# Altium schematic sheet AIMLAB_TESTSTATION_ADC_V1.schdoc
size D
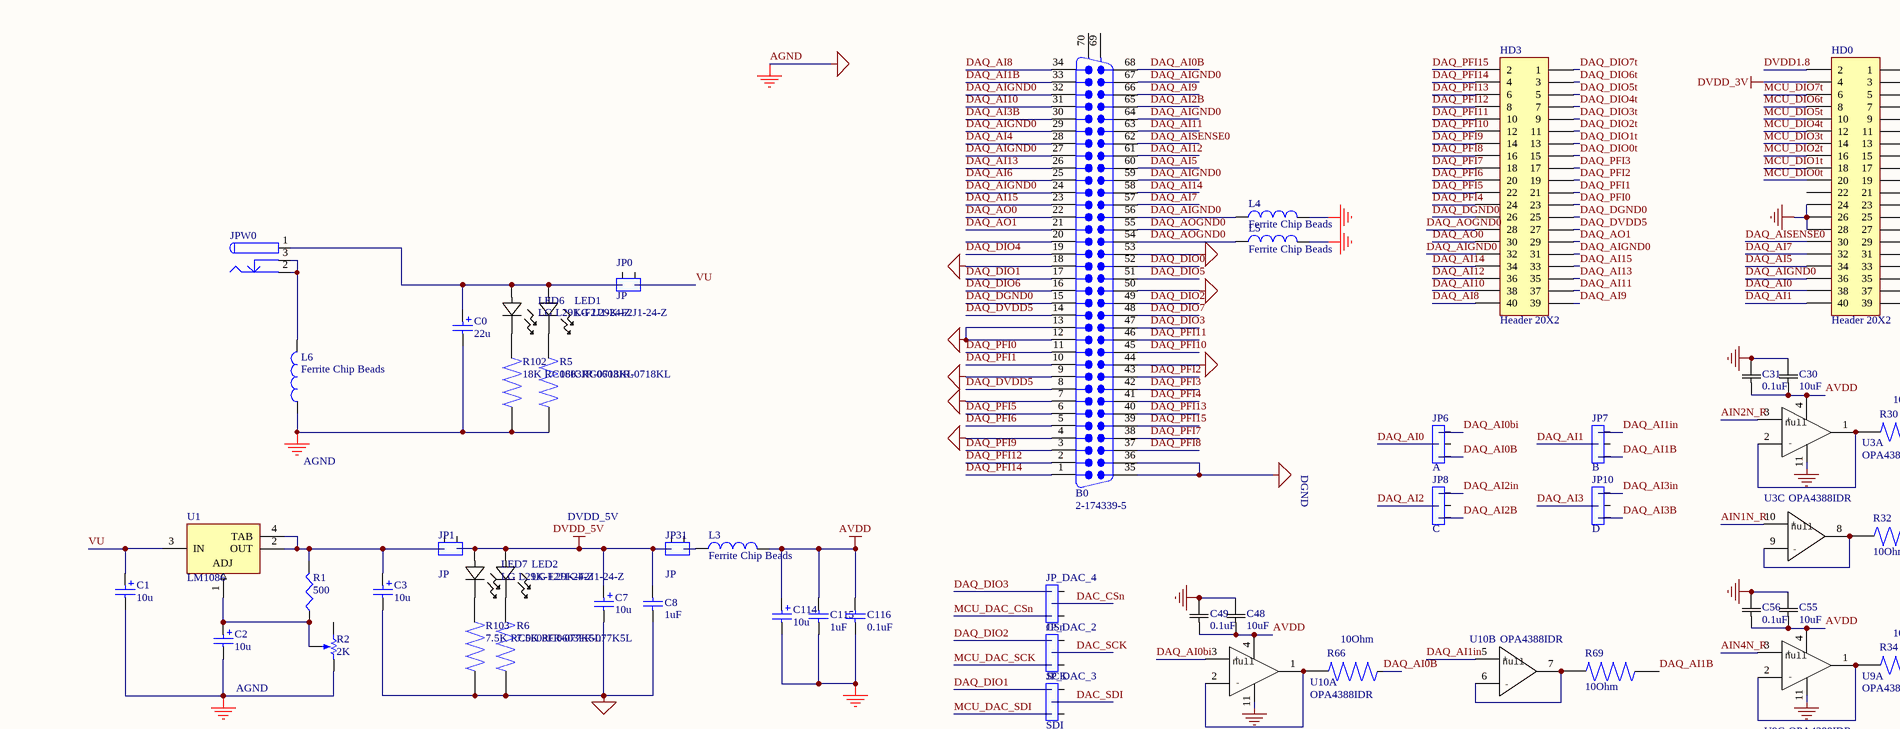
[diagram p0: AIMLAB_TESTSTATION_ADC_V1.schdoc, top left]
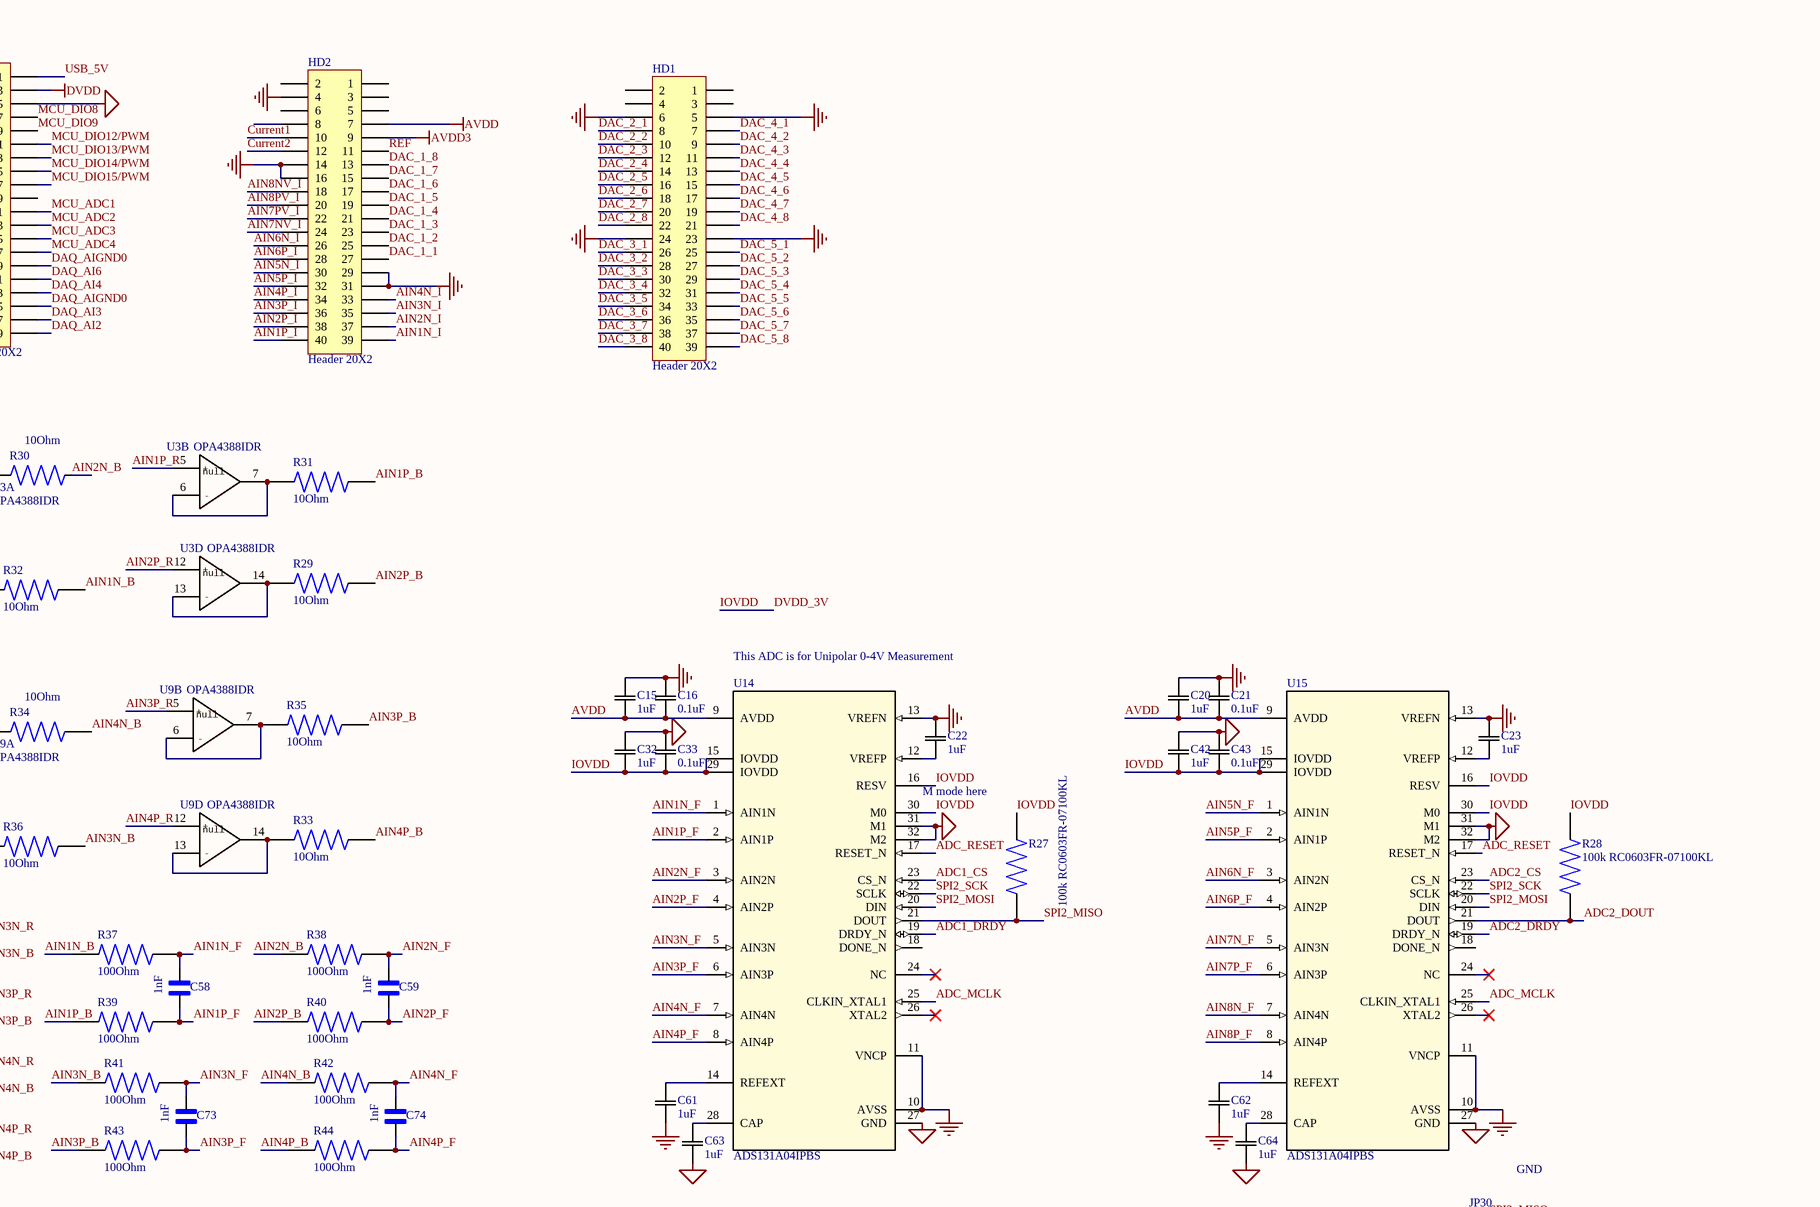
[diagram p1: AIMLAB_TESTSTATION_ADC_V1.schdoc, top right]
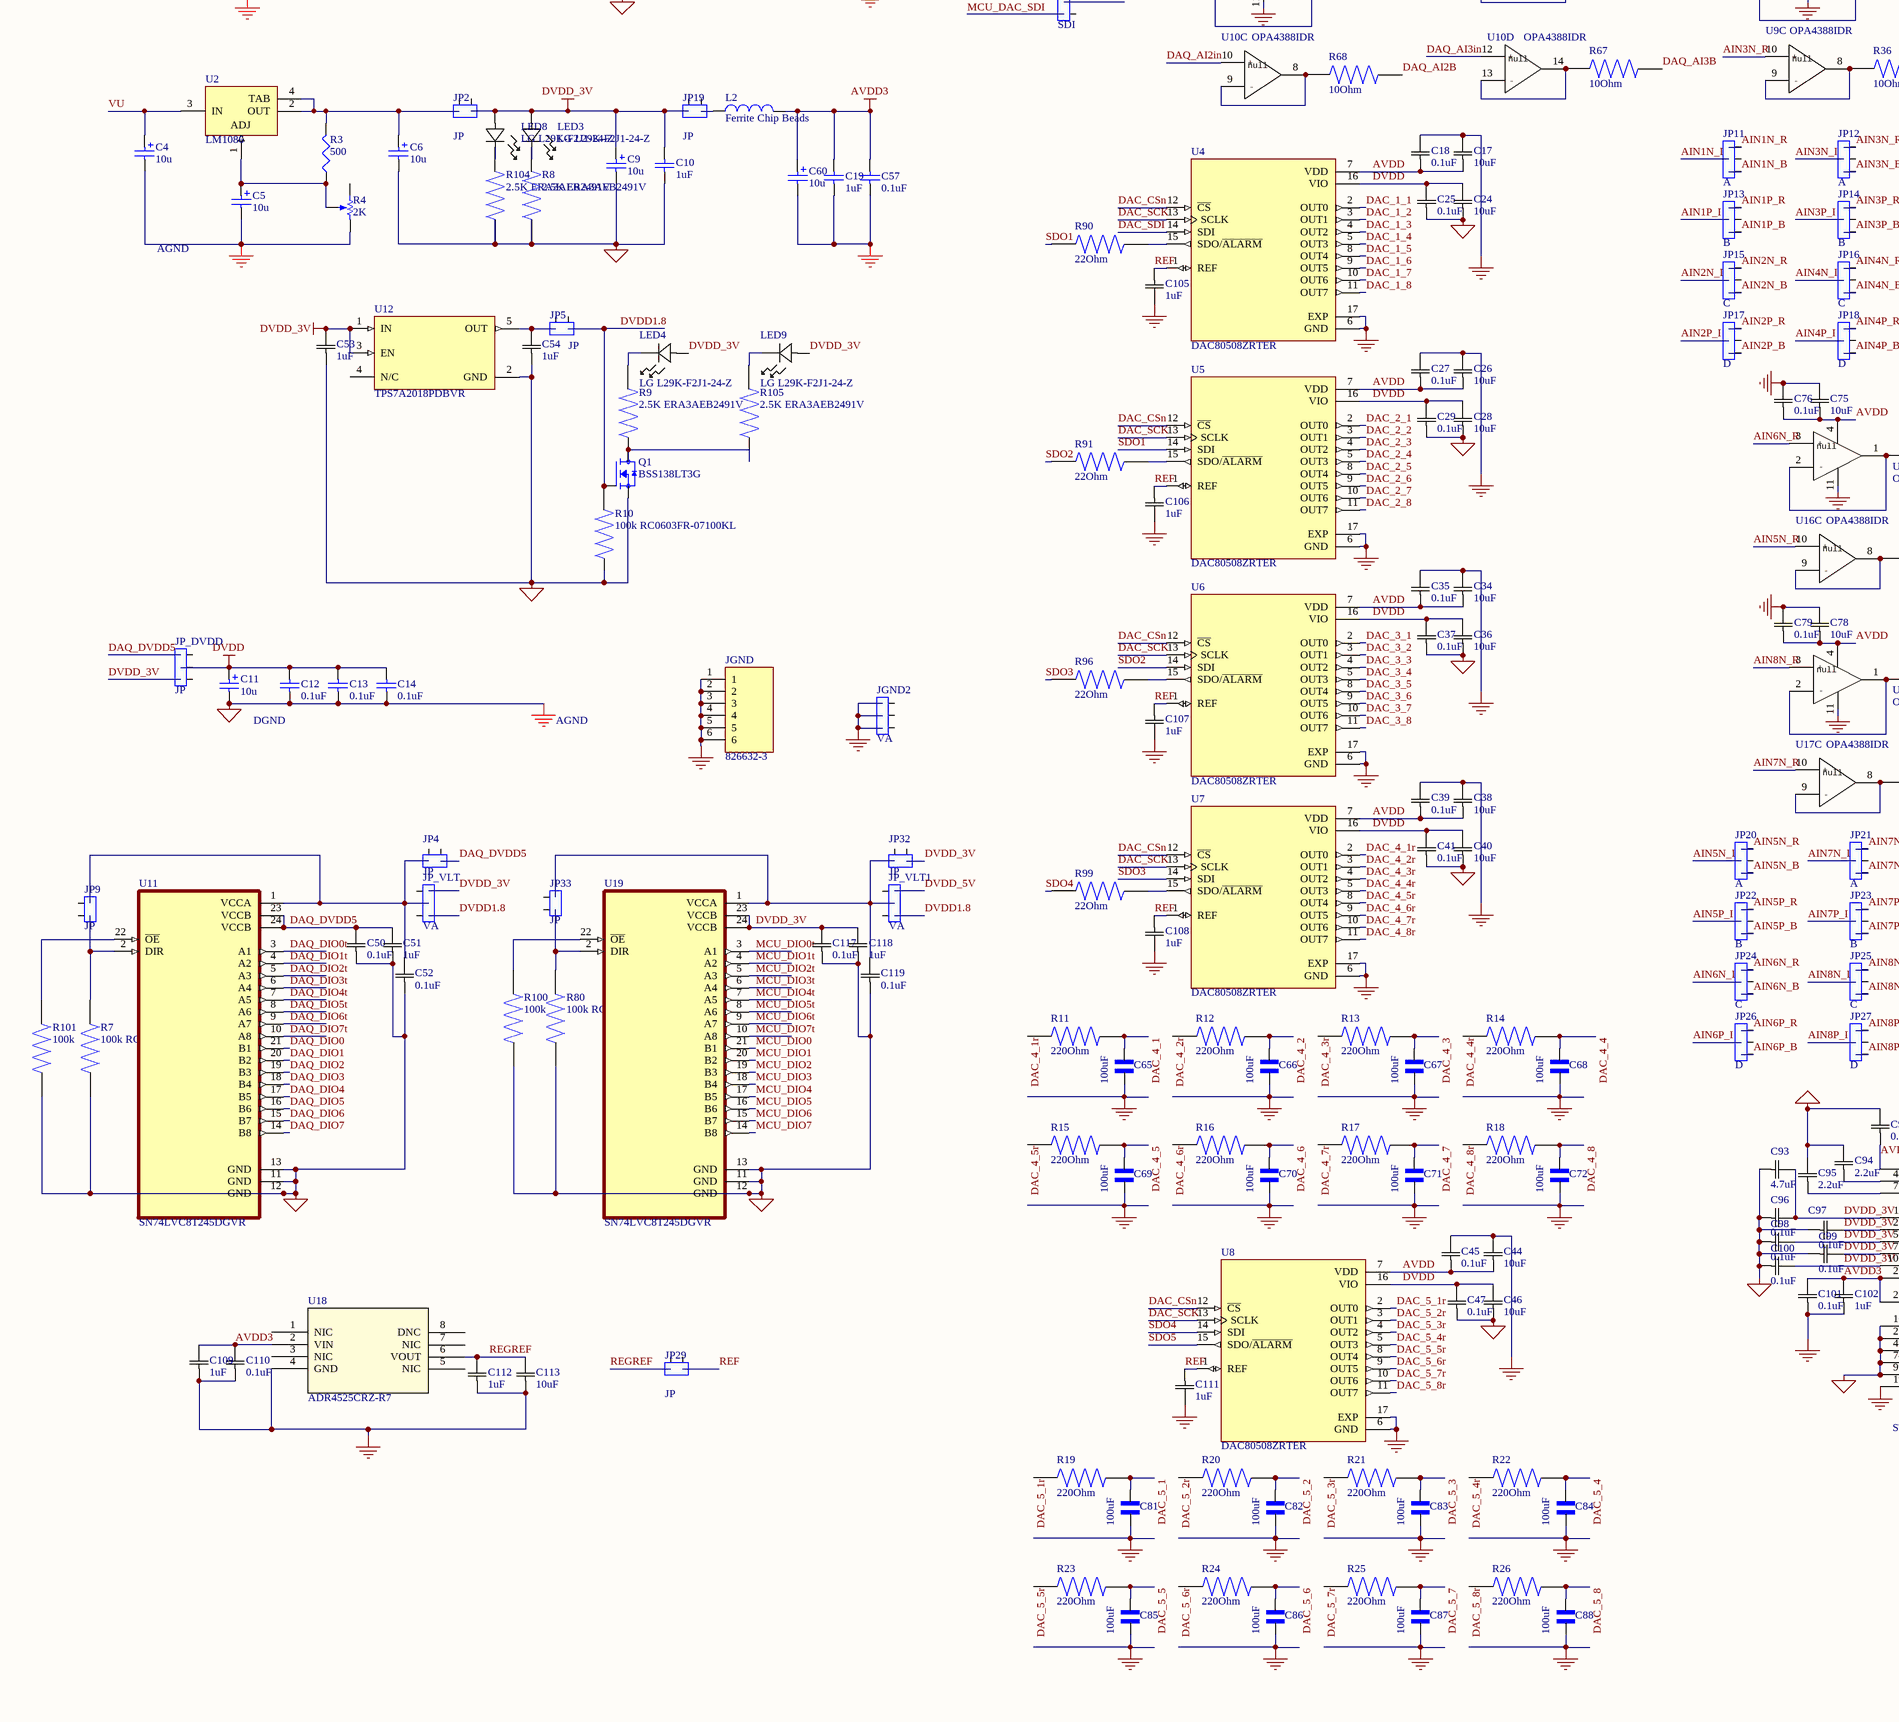
[diagram p2: AIMLAB_TESTSTATION_ADC_V1.schdoc, bottom left]
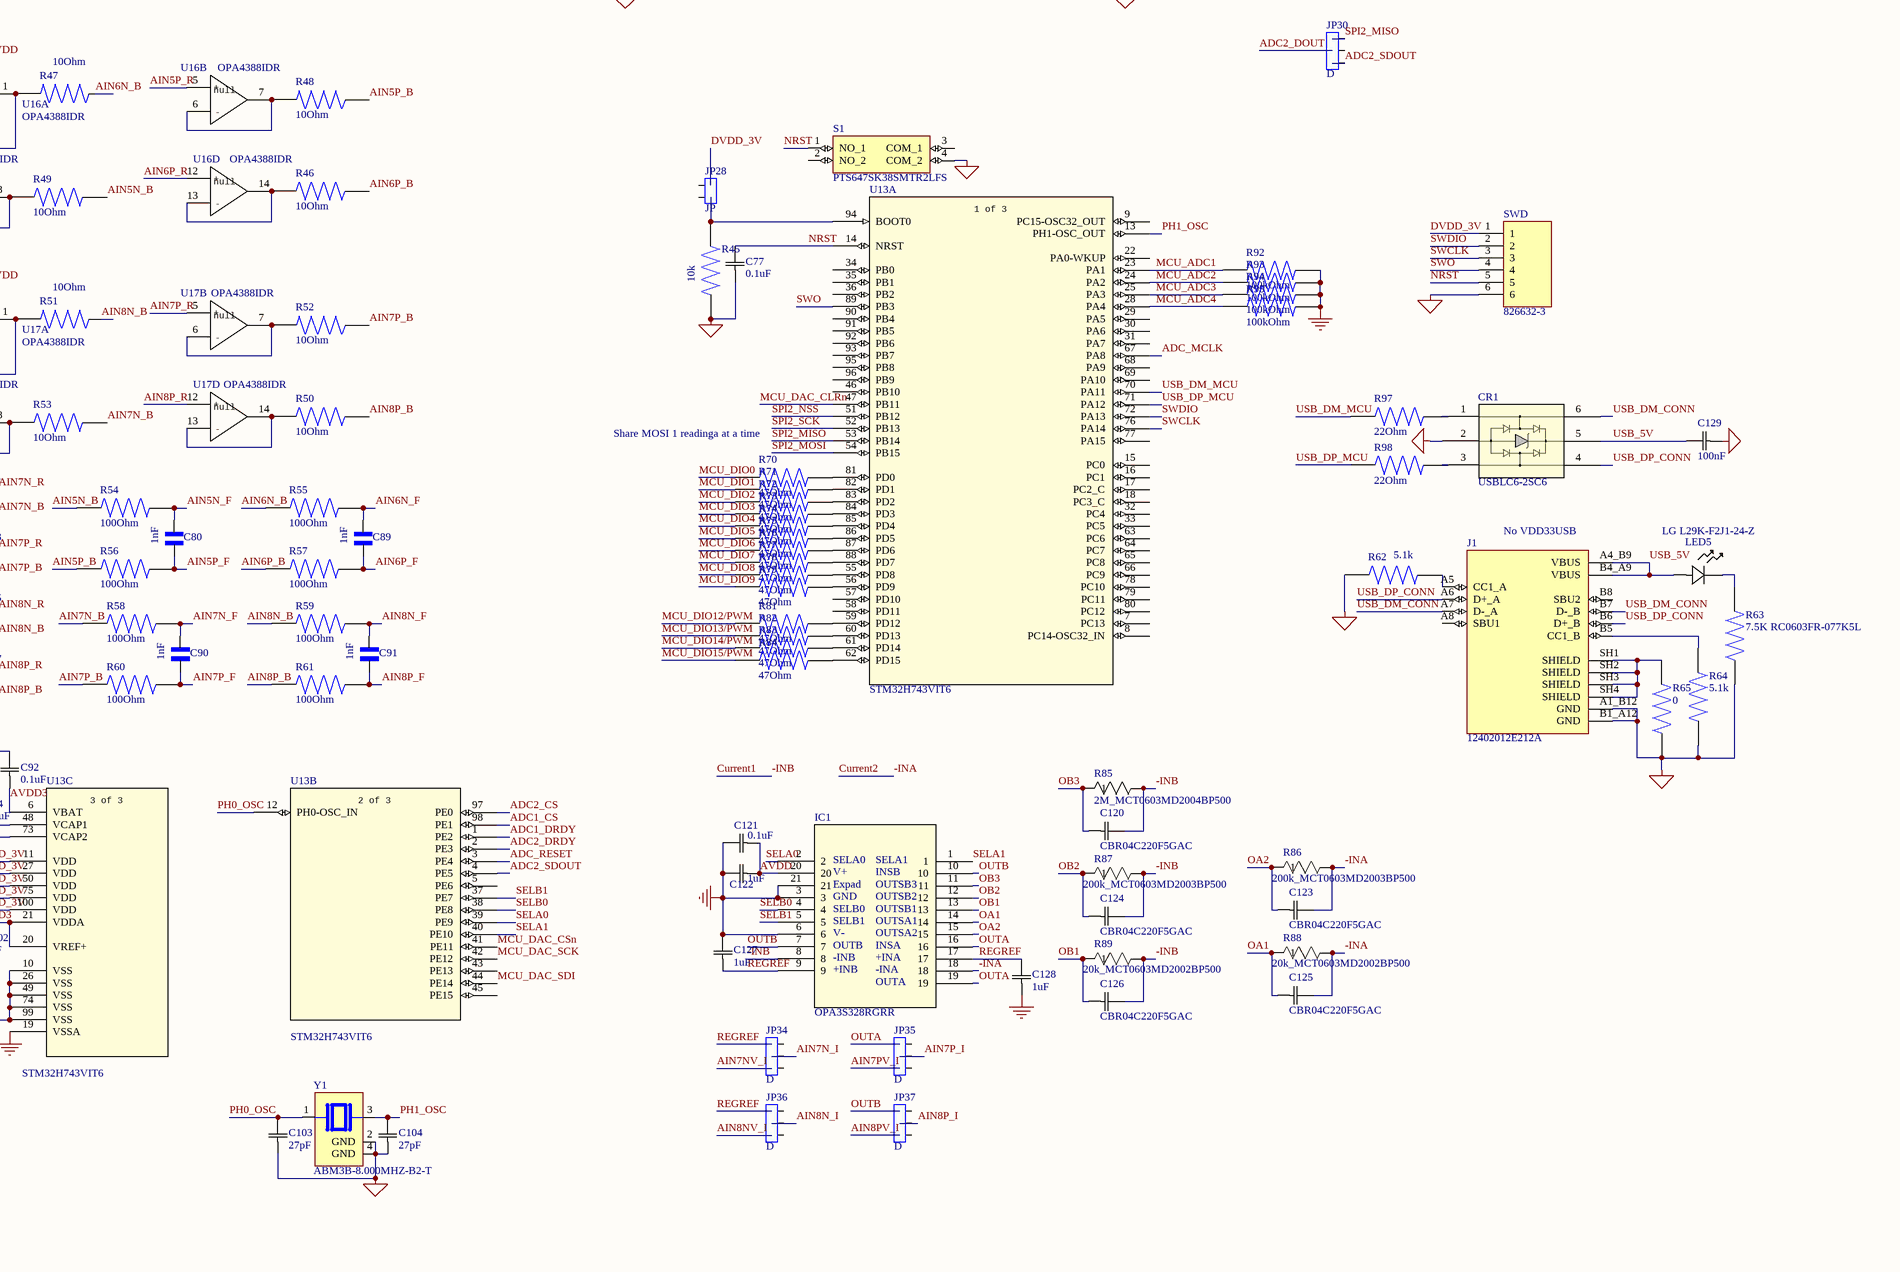
[diagram p3: AIMLAB_TESTSTATION_ADC_V1.schdoc, bottom right]

## Parts
B0  2-174339-5  [CONN68_5174339_TEC]
C0  22u  [PolarizedCap]
C1  10u  [PolarizedCap]
C2  10u  [PolarizedCap]
C3  10u  [PolarizedCap]
C4  10u  [PolarizedCap]
C5  10u  [PolarizedCap]
C6  10u  [PolarizedCap]
C7  10u  [PolarizedCap]
C8  1uF  [CAPC2012X140N]
C9  10u  [PolarizedCap]
C10  1uF  [CAPC2012X140N]
C11  10u  [PolarizedCap]
C12  0.1uF  [CAPC2012X140N]
C13  0.1uF  [CAPC2012X140N]
C14  0.1uF  [CAPC2012X140N]
C15  1uF  [CAPC1608X90]
C16  0.1uF  [CAPC1608X90]
C17  10uF  [CAPC2012X140N]
C18  0.1uF  [CAPC1608X90]
C19  1uF  [CAPC2012X140N]
C20  1uF  [CAPC1608X90]
C21  0.1uF  [CAPC1608X90]
C22  1uF  [CAPC1608X90]
C23  1uF  [CAPC1608X90]
C24  10uF  [CAPC2012X140N]
C25  0.1uF  [CAPC1608X90]
C26  10uF  [CAPC2012X140N]
C27  0.1uF  [CAPC1608X90]
C28  10uF  [CAPC2012X140N]
C29  0.1uF  [CAPC1608X90]
C30  10uF  [CAPC2012X140N]
C31  0.1uF  [CAPC1608X90]
C32  1uF  [CAPC1608X90]
C33  0.1uF  [CAPC1608X90]
C34  10uF  [CAPC2012X140N]
C35  0.1uF  [CAPC1608X90]
C36  10uF  [CAPC2012X140N]
C37  0.1uF  [CAPC1608X90]
C38  10uF  [CAPC2012X140N]
C39  0.1uF  [CAPC1608X90]
C40  10uF  [CAPC2012X140N]
C41  0.1uF  [CAPC1608X90]
C42  1uF  [CAPC1608X90]
C43  0.1uF  [CAPC1608X90]
C44  10uF  [CAPC2012X140N]
C45  0.1uF  [CAPC1608X90]
C46  10uF  [CAPC2012X140N]
C47  0.1uF  [CAPC1608X90]
C48  10uF  [CAPC2012X140N]
C49  0.1uF  [CAPC1608X90]
C50  0.1uF  [CAPC1608X90]
C51  1uF  [CAPC1608X90]
C52  0.1uF  [CAPC1608X90]
C53  1uF  [CAPC2012X140N]
C54  1uF  [CAPC2012X140N]
C55  10uF  [CAPC2012X140N]
C56  0.1uF  [CAPC1608X90]
C57  0.1uF  [CAPC2012X140N]
C58  1nF  [CAPC2012X145N]
C59  1nF  [CAPC2012X145N]
C60  10u  [PolarizedCap]
C61  1uF  [CAPC1608X90]
C62  1uF  [CAPC1608X90]
C63  1uF  [CAPC1608X90]
C64  1uF  [CAPC1608X90]
C65  100uF  [CAPC2012X145N]
C66  100uF  [CAPC2012X145N]
C67  100uF  [CAPC2012X145N]
C68  100uF  [CAPC2012X145N]
C69  100uF  [CAPC2012X145N]
C70  100uF  [CAPC2012X145N]
C71  100uF  [CAPC2012X145N]
C72  100uF  [CAPC2012X145N]
C73  1nF  [CAPC2012X145N]
C74  1nF  [CAPC2012X145N]
C75  10uF  [CAPC2012X140N]
C76  0.1uF  [CAPC1608X90]
C77  0.1uF  [CAPC1608X90]
C78  10uF  [CAPC2012X140N]
C79  0.1uF  [CAPC1608X90]
C80  1nF  [CAPC2012X145N]
C81  100uF  [CAPC2012X145N]
C82  100uF  [CAPC2012X145N]
C83  100uF  [CAPC2012X145N]
C84  100uF  [CAPC2012X145N]
C85  100uF  [CAPC2012X145N]
C86  100uF  [CAPC2012X145N]
C87  100uF  [CAPC2012X145N]
C88  100uF  [CAPC2012X145N]
C89  1nF  [CAPC2012X145N]
C90  1nF  [CAPC2012X145N]
C91  1nF  [CAPC2012X145N]
C92  0.1uF  [CAPC1608X90]
C93  4.7uF  [CAPC1608X90]
C94  2.2uF  [CAPC1608X90]
C95  2.2uF  [CAPC1608X90]
C96  0.1uF  [CAPC1608X90]
C97  0.1uF  [CAPC1608X90]
C98  0.1uF  [CAPC1608X90]
C99  0.1uF  [CAPC1608X90]
C100  0.1uF  [CAPC1608X90]
C101  0.1uF  [CAPC1608X90]
C102  1uF  [CAPC1608X90]
C103  27pF  [CAPC1608X90]
C104  27pF  [CAPC1608X90]
C105  1uF  [CAPC1608X90]
C106  1uF  [CAPC1608X90]
C107  1uF  [CAPC1608X90]
C108  1uF  [CAPC1608X90]
C109  1uF  [CAPC1608X90]
C110  0.1uF  [CAPC1608X90]
C111  1uF  [CAPC1608X90]
C112  1uF  [CAPC1608X90]
C113  10uF  [CAPC2012X140N]
C114  10u  [PolarizedCap]
C115  1uF  [CAPC2012X140N]
C116  0.1uF  [CAPC2012X140N]
C117  0.1uF  [CAPC1608X90]
C118  1uF  [CAPC1608X90]
C119  0.1uF  [CAPC1608X90]
C120  CBR04C220F5GAC  [CAPC1005X55N]
C121  0.1uF  [CAPC1608X90]
C122  1uF  [CAPC1608X90]
C123  CBR04C220F5GAC  [CAPC1005X55N]
C124  CBR04C220F5GAC  [CAPC1005X55N]
C125  CBR04C220F5GAC  [CAPC1005X55N]
C126  CBR04C220F5GAC  [CAPC1005X55N]
C127  1uF  [CAPC1608X90]
C128  1uF  [CAPC1608X90]
C129  100nF  [CAPC1608X90]
CR1  USBLC6-2SC6  [SOT23-6L_STM]
HD0  Header 20X2  [ZIF40]
HD1  Header 20X2  [ZIF40]
HD2  Header 20X2  [ZIF40]
HD3  Header 20X2  [ZIF40]
IC1  OPA3S328RGRR  [VQFN20_3P5X3P5_TEX]
J1  12402012E212A  [AMPHENOL_12402012E212A]
JGND  826632-3  [TE_826632-3]
JGND2  VA  [HDR1X3]
JP0  JP  [HDR1X2]
JP1  JP  [HDR1X2]
JP2  JP  [HDR1X2]
JP4  JP  [HDR1X2]
JP5  JP  [HDR1X2]
JP6  A  [JumperRes]
JP7  B  [JumperRes]
JP8  C  [JumperRes]
JP9  JP  [HDR1X2]
JP10  D  [JumperRes]
JP11  A  [JumperRes]
JP12  A  [JumperRes]
JP13  B  [JumperRes]
JP14  B  [JumperRes]
JP15  C  [JumperRes]
JP16  C  [JumperRes]
JP17  D  [JumperRes]
JP18  D  [JumperRes]
JP19  JP  [HDR1X2]
JP20  A  [JumperRes]
JP21  A  [JumperRes]
JP22  B  [JumperRes]
JP23  B  [JumperRes]
JP24  C  [JumperRes]
JP25  C  [JumperRes]
JP26  D  [JumperRes]
JP27  D  [JumperRes]
JP28  JP  [HDR1X2]
JP29  JP  [CAPC1608X90]
JP30  D  [JumperRes]
JP31  JP  [HDR1X2]
JP32  JP  [HDR1X2]
JP33  JP  [HDR1X2]
JP34  D  [JumperRes]
JP35  D  [JumperRes]
JP36  D  [JumperRes]
JP37  D  [JumperRes]
JP_DAC_2  SCK  [HDR1X3]
JP_DAC_3  SDI  [HDR1X3]
JP_DAC_4  CSn  [HDR1X3]
JP_DVDD  JP  [HDR1X3]
JP_VLT  VA  [HDR1X3]
JP_VLT1  VA  [HDR1X3]
JPW0  (no value)  [KLD-0202_]
L2  Ferrite Chip Beads  [Inductor]
L3  Ferrite Chip Beads  [Inductor]
L4  Ferrite Chip Beads  [Inductor]
L5  Ferrite Chip Beads  [Inductor]
L6  Ferrite Chip Beads  [Inductor]
LED1  LG L29K-F2J1-24-Z  [CAPC1608X90]
LED2  LG L29K-F2J1-24-Z  [CAPC1608X90]
LED3  LG L29K-F2J1-24-Z  [CAPC1608X90]
LED4  LG L29K-F2J1-24-Z  [CAPC1608X90]
LED5  LG L29K-F2J1-24-Z  [CAPC1608X90]
LED6  LG L29K-F2J1-24-Z  [CAPC1608X90]
LED7  LG L29K-F2J1-24-Z  [CAPC1608X90]
LED8  LG L29K-F2J1-24-Z  [CAPC1608X90]
LED9  LG L29K-F2J1-24-Z  [CAPC1608X90]
Q1  BSS138LT3G  [SOT95P237X111-3N]
R1  500  [Resistor]
R2  2K  [POT4MM-2]
R3  500  [Resistor]
R4  2K  [POT4MM-2]
R5  18K RC0603JR-0718KL  [RES_ERA3AEB2491V]
R6  7.5K RC0603FR-077K5L  [RES_ERA3AEB2491V]
R7  100k RC0603FR-07100KL  [RES_ERA3AEB2491V]
R8  2.5K ERA3AEB2491V  [RES_ERA3AEB2491V]
R9  2.5K ERA3AEB2491V  [RES_ERA3AEB2491V]
R10  100k RC0603FR-07100KL  [RES_ERA3AEB2491V]
R11  220Ohm  [RESC1608X50N]
R12  220Ohm  [RESC1608X50N]
R13  220Ohm  [RESC1608X50N]
R14  220Ohm  [RESC1608X50N]
R15  220Ohm  [RESC1608X50N]
R16  220Ohm  [RESC1608X50N]
R17  220Ohm  [RESC1608X50N]
R18  220Ohm  [RESC1608X50N]
R19  220Ohm  [RESC1608X50N]
R20  220Ohm  [RESC1608X50N]
R21  220Ohm  [RESC1608X50N]
R22  220Ohm  [RESC1608X50N]
R23  220Ohm  [RESC1608X50N]
R24  220Ohm  [RESC1608X50N]
R25  220Ohm  [RESC1608X50N]
R26  220Ohm  [RESC1608X50N]
R27  100k RC0603FR-07100KL  [RES_ERA3AEB2491V]
R28  100k RC0603FR-07100KL  [RES_ERA3AEB2491V]
R29  10Ohm  [RESC1608X50N]
R30  10Ohm  [RESC1608X50N]
R31  10Ohm  [RESC1608X50N]
R32  10Ohm  [RESC1608X50N]
R33  10Ohm  [RESC1608X50N]
R34  10Ohm  [RESC1608X50N]
R35  10Ohm  [RESC1608X50N]
R36  10Ohm  [RESC1608X50N]
R37  100Ohm  [RESC1608X50N]
R38  100Ohm  [RESC1608X50N]
R39  100Ohm  [RESC1608X50N]
R40  100Ohm  [RESC1608X50N]
R41  100Ohm  [RESC1608X50N]
R42  100Ohm  [RESC1608X50N]
R43  100Ohm  [RESC1608X50N]
R44  100Ohm  [RESC1608X50N]
R45  10k  [RES_ERA3AEB2491V]
R46  10Ohm  [RESC1608X50N]
R47  10Ohm  [RESC1608X50N]
R48  10Ohm  [RESC1608X50N]
R49  10Ohm  [RESC1608X50N]
R50  10Ohm  [RESC1608X50N]
R51  10Ohm  [RESC1608X50N]
R52  10Ohm  [RESC1608X50N]
R53  10Ohm  [RESC1608X50N]
R54  100Ohm  [RESC1608X50N]
R55  100Ohm  [RESC1608X50N]
R56  100Ohm  [RESC1608X50N]
R57  100Ohm  [RESC1608X50N]
R58  100Ohm  [RESC1608X50N]
R59  100Ohm  [RESC1608X50N]
R60  100Ohm  [RESC1608X50N]
R61  100Ohm  [RESC1608X50N]
R62  5.1k  [RES_ERA3AEB2491V]
R63  7.5K RC0603FR-077K5L  [RES_ERA3AEB2491V]
R64  5.1k  [RES_ERA3AEB2491V]
R65  0  [RES_ERA3AEB2491V]
R66  10Ohm  [RESC1608X50N]
R67  10Ohm  [RESC1608X50N]
R68  10Ohm  [RESC1608X50N]
R69  10Ohm  [RESC1608X50N]
R70  47Ohm  [CAPC1608X90]
R71  47Ohm  [CAPC1608X90]
R72  47Ohm  [CAPC1608X90]
R73  47Ohm  [CAPC1608X90]
R74  47Ohm  [CAPC1608X90]
R75  47Ohm  [CAPC1608X90]
R76  47Ohm  [CAPC1608X90]
R77  47Ohm  [CAPC1608X90]
R78  47Ohm  [CAPC1608X90]
R79  47Ohm  [CAPC1608X90]
R80  100k RC0603FR-07100KL  [RES_ERA3AEB2491V]
R81  47Ohm  [CAPC1608X90]
R82  47Ohm  [CAPC1608X90]
R83  47Ohm  [CAPC1608X90]
R84  47Ohm  [CAPC1608X90]
R85  2M_MCT0603MD2004BP500  [CAPC1608X90]
R86  200k_MCT0603MD2003BP500  [CAPC1608X90]
R87  200k_MCT0603MD2003BP500  [CAPC1608X90]
R88  20k_MCT0603MD2002BP500  [CAPC1608X90]
R89  20k_MCT0603MD2002BP500  [CAPC1608X90]
R90  22Ohm  [RES_ERA3AEB2491V]
R91  22Ohm  [RES_ERA3AEB2491V]
R92  100kOhm  [CAPC1608X90]
R93  100kOhm  [CAPC1608X90]
R94  100kOhm  [CAPC1608X90]
R95  100kOhm  [CAPC1608X90]
R96  22Ohm  [RES_ERA3AEB2491V]
R97  22Ohm  [RES_ERA3AEB2491V]
R98  22Ohm  [RES_ERA3AEB2491V]
R99  22Ohm  [RES_ERA3AEB2491V]
R100  100k  [RES_ERA3AEB2491V]
R101  100k  [RES_ERA3AEB2491V]
R102  18K RC0603JR-0718KL  [RES_ERA3AEB2491V]
R103  7.5K RC0603FR-077K5L  [RES_ERA3AEB2491V]
R104  2.5K ERA3AEB2491V  [RES_ERA3AEB2491V]
R105  2.5K ERA3AEB2491V  [RES_ERA3AEB2491V]
S1  PTS647SK38SMTR2LFS  [PTS647SK38SMTR2LFS]
SWD  826632-3  [TE_826632-3]
U1  LM1086  [TO-263-3]
U2  LM1086  [TO-263-3]
U3  OPA4388IDR  [D0014A-IPC_A]  (parts A,B,C,D of 4)
U4  DAC80508ZRTER  [QFN50P300X300X80-17N]
U5  DAC80508ZRTER  [QFN50P300X300X80-17N]
U6  DAC80508ZRTER  [QFN50P300X300X80-17N]
U7  DAC80508ZRTER  [QFN50P300X300X80-17N]
U8  DAC80508ZRTER  [QFN50P300X300X80-17N]
U9  OPA4388IDR  [D0014A-IPC_A]  (parts A,B,C,D of 4)
U10  OPA4388IDR  [D0014A-IPC_A]  (parts A,B,C,D of 4)
U11  SN74LVC8T245DGVR  [SOP40P640X120-24N]
U12  TPS7A2018PDBVR  [SOT95P280X145-5N]
U13  STM32H743VIT6  [LQFP100-14x14mm]  (parts A,B,C of 3)
U14  ADS131A04IPBS  [PBS0032A_N]
U15  ADS131A04IPBS  [PBS0032A_N]
U16  OPA4388IDR  [D0014A-IPC_A]  (parts A,B,C,D of 4)
U17  OPA4388IDR  [D0014A-IPC_A]  (parts A,B,C,D of 4)
U18  ADR4525CRZ-R7  [R-8_ADI]
U19  SN74LVC8T245DGVR  [SOP40P640X120-24N]
Y1  ABM3B-8.000MHZ-B2-T  [XTAL_ABM3B-8.000MHZ-B2-T]

## Nets
AGND: B0.4 B0.7 B0.9 B0.12 B0.13 B0.18 B0.35 B0.36 B0.44 B0.50 B0.53 C0.2 C1.2 C2.2 C3.2 C4.2 C5.2 C6.2 C7.2 C8.2 C9.2 C10.1 C11.2 C12.2 C13.2 C14.2 C15.1 C16.1 C17.2 C18.2 C19.2 C20.1 C21.1 C22.2 C23.2 C24.1 C25.1 C26.2 C27.2 C28.1 C29.1 C30.2 C31.2 C32.1 C33.1 C34.2 C35.2 C36.1 C37.1 C38.2 C39.2 C40.1 C41.1 C42.1 C43.1 C44.2 C45.2 C46.1 C47.1 C48.2 C49.2 C50.1 C51.1 C52.1 C53.1 C54.1 C55.2 C56.2 C57.2 C60.2 C61.1 C62.1 C63.1 C64.1 C65.1 C66.1 C67.1 C68.1 C69.1 C70.1 C71.1 C72.1 C75.2 C76.2 C77.1 C78.2 C79.2 C81.1 C82.1 C83.1 C84.1 C85.1 C86.1 C87.1 C88.1 C92.2 C93.1 C94.2 C95.2 C96.1 C97.1 C98.1 C99.1 C100.1 C101.1 C102.1 C103.1 C104.1 C105.2 C106.2 C107.2 C108.2 C109.1 C110.1 C111.2 C112.1 C113.1 C114.2 C115.2 C116.2 C117.1 C118.1 C119.1 C121.2 C122.2 C127.2 C128.1 C129.1 CR1.2 HD0.5 HD0.24 HD0.26 HD0.28 HD1.5 HD1.6 HD1.23 HD1.24 HD2.4 HD2.14 HD2.16 HD2.29 HD2.31 IC1.3 IC1.6 IC1.21 J1.A1_B12(GND) J1.B1_A12(GND) JGND.1 JGND.2 JGND.3 JGND.4 JGND.5 JGND.6 JGND2.1 JGND2.2 JGND2.3 L4.1 L5.1 L6.2 Q1.2(S) R2.3(BOT) R4.3(BOT) R5.1 R6.1 R7.2 R8.1 R10.1 R45.2 R62.1 R63.1 R64.2 R65.1 R80.2 R92.2 R93.2 R94.2 R95.2 R100.2 R101.2 R102.1 R103.1 R104.1 S1.4(COM_2) SWD.6 U3.11(V-) U4.6(GND) U4.17(EXP) U5.6(GND) U5.17(EXP) U6.6(GND) U6.17(EXP) U7.6(GND) U7.17(EXP) U8.6(GND) U8.17(EXP) U9.11(V-) U10.11(V-) U11.11(GND) U11.12(GND) U11.13(GND) U12.2(GND) U13.10(VSS) U13.19(VSSA) U13.26(VSS) U13.49(VSS) U13.74(VSS) U13.99(VSS) U14.10(AVSS) U14.11(VNCP) U14.13(VREFN) U14.27(GND) U14.31(M1) U14.32(M2) U15.10(AVSS) U15.11(VNCP) U15.13(VREFN) U15.27(GND) U15.31(M1) U15.32(M2) U16.11(V-) U17.11(V-) U18.4(GND) U19.11(GND) U19.12(GND) U19.13(GND) Y1.2(GND) Y1.4(GND)  [also labelled DGND]
AVDD: C15.2 C16.2 C17.1 C18.1 C20.2 C21.2 C26.1 C27.1 C30.1 C31.1 C34.1 C35.1 C38.1 C39.1 C44.1 C45.1 C48.1 C49.1 C55.1 C56.1 C75.1 C76.1 C78.1 C79.1 C114.1 C115.1 C116.1 C121.1 C122.1 HD2.7 IC1.20 L3.1 U3.4(V+) U4.7(VDD) U5.7(VDD) U6.7(VDD) U7.7(VDD) U8.7(VDD) U9.4(V+) U10.4(V+) U14.9(AVDD) U15.9(AVDD) U16.4(V+) U17.4(V+)
AVDD3: C19.1 C57.1 C60.1 C92.1 C101.2 C102.2 C109.2 C110.2 HD2.9 L2.1 U13.6(VBAT) U13.20(VREF+) U13.21(VDDA) U18.2(VIN)
DVDD: C11.1 C12.1 C13.1 C14.1 C24.2 C25.2 C28.2 C29.2 C36.2 C37.2 C40.2 C41.2 C46.2 C47.2 HD0.3 JP_DVDD.2 U4.16(VIO) U5.16(VIO) U6.16(VIO) U7.16(VIO) U8.16(VIO)
DVDD_3V: C9.1 C10.2 C32.2 C33.2 C42.2 C43.2 C53.2 C93.2 C96.2 C97.2 C98.2 C99.2 C100.2 C117.2 C118.2 HD0.4 JP2.2 JP19.1 JP28.2 JP32.1 JP_DVDD.3 JP_VLT.1 LED3.2 LED4.2 LED8.2 LED9.2 R27.2 R28.2 SWD.1 U12.1(IN) U12.3(EN) U13.11(VDD) U13.27(VDD) U13.50(VDD) U13.75(VDD) U13.100(VDD) U14.15(IOVDD) U14.16(RESV) U14.29(IOVDD) U14.30(M0) U15.15(IOVDD) U15.16(RESV) U15.29(IOVDD) U15.30(M0) U19.23(VCCB) U19.24(VCCB)  [also labelled IOVDD]
DVDD_5V: C7.1 C8.1 JP1.2 JP31.1 JP_VLT1.1 LED2.2 LED7.2
-INA: C123.2 C125.2 HD2.12 IC1.18 R86.2 R88.2  [also labelled Current2]
-INB: C120.2 C124.2 C126.2 HD2.10 IC1.8 R85.2 R87.2 R89.2  [also labelled Current1]
ADC1_CS: U13.98(PE1) U14.23(CS_N)
ADC1_DRDY: U13.1(PE2) U14.19(DRDY_N)
ADC2_CS: U13.97(PE0) U15.23(CS_N)
ADC2_DOUT: JP30.2 R28.1 U15.21(DOUT)
ADC2_DRDY: U13.2(PE3) U15.19(DRDY_N)
ADC2_SDOUT: JP30.3 U13.4(PE5)
ADC_MCLK: U13.67(PA8) U14.25(CLKIN_XTAL1) U15.25(CLKIN_XTAL1)
ADC_RESET: U13.3(PE4) U14.17(RESET_N) U15.17(RESET_N)
AIN1N_B: JP11.3 R32.2 R37.1
AIN1N_F: C58.2 R37.2 U14.1(AIN1N)
AIN1N_I: HD2.39 JP11.2
AIN1N_R: JP11.1 U3.10(+IN_C)
AIN1P_B: JP13.3 R31.1 R39.1
AIN1P_F: C58.1 R39.2 U14.2(AIN1P)
AIN1P_I: HD2.40 JP13.2
AIN1P_R: JP13.1 U3.5(+IN_B)
AIN2N_B: JP15.3 R30.1 R38.1
AIN2N_F: C59.2 R38.2 U14.3(AIN2N)
AIN2N_I: HD2.37 JP15.2
AIN2N_R: JP15.1 U3.3(+IN_A)
AIN2P_B: JP17.3 R29.2 R40.1
AIN2P_F: C59.1 R40.2 U14.4(AIN2P)
AIN2P_I: HD2.38 JP17.2
AIN2P_R: JP17.1 U3.12(+IN_D)
AIN3N_B: JP12.3 R36.2 R41.1
AIN3N_F: C73.2 R41.2 U14.5(AIN3N)
AIN3N_I: HD2.35 JP12.2
AIN3N_R: JP12.1 U9.10(+IN_C)
AIN3P_B: JP14.3 R35.1 R43.1
AIN3P_F: C73.1 R43.2 U14.6(AIN3P)
AIN3P_I: HD2.36 JP14.2
AIN3P_R: JP14.1 U9.5(+IN_B)
AIN4N_B: JP16.3 R34.1 R42.1
AIN4N_F: C74.2 R42.2 U14.7(AIN4N)
AIN4N_I: HD2.33 JP16.2
AIN4N_R: JP16.1 U9.3(+IN_A)
AIN4P_B: JP18.3 R33.2 R44.1
AIN4P_F: C74.1 R44.2 U14.8(AIN4P)
AIN4P_I: HD2.34 JP18.2
AIN4P_R: JP18.1 U9.12(+IN_D)
AIN5N_B: JP20.3 R49.2 R54.1
AIN5N_F: C80.2 R54.2 U15.1(AIN1N)
AIN5N_I: HD2.30 JP20.2
AIN5N_R: JP20.1 U16.10(+IN_C)
AIN5P_B: JP22.3 R48.1 R56.1
AIN5P_F: C80.1 R56.2 U15.2(AIN1P)
AIN5P_I: HD2.32 JP22.2
AIN5P_R: JP22.1 U16.5(+IN_B)
AIN6N_B: JP24.3 R47.1 R55.1
AIN6N_F: C89.2 R55.2 U15.3(AIN2N)
AIN6N_I: HD2.26 JP24.2
AIN6N_R: JP24.1 U16.3(+IN_A)
AIN6P_B: JP26.3 R46.2 R57.1
AIN6P_F: C89.1 R57.2 U15.4(AIN2P)
AIN6P_I: HD2.28 JP26.2
AIN6P_R: JP26.1 U16.12(+IN_D)
AIN7N_B: JP21.3 R53.2 R58.1
AIN7N_F: C90.2 R58.2 U15.5(AIN3N)
AIN7N_I: JP21.2 JP34.2
AIN7N_R: JP21.1 U17.10(+IN_C)
AIN7NV_I: HD2.24 JP34.3
AIN7P_B: JP23.3 R52.1 R60.1
AIN7P_F: C90.1 R60.2 U15.6(AIN3P)
AIN7P_I: JP23.2 JP35.2
AIN7P_R: JP23.1 U17.5(+IN_B)
AIN7PV_I: HD2.22 JP35.3
AIN8N_B: JP25.3 R51.1 R59.1
AIN8N_F: C91.2 R59.2 U15.7(AIN4N)
AIN8N_I: JP25.2 JP36.2
AIN8N_R: JP25.1 U17.3(+IN_A)
AIN8NV_I: HD2.18 JP36.3
AIN8P_B: JP27.3 R50.2 R61.1
AIN8P_F: C91.1 R61.2 U15.8(AIN4P)
AIN8P_I: JP27.2 JP37.2
AIN8P_R: JP27.1 U17.12(+IN_D)
AIN8PV_I: HD2.20 JP37.3
DAC_1_1: HD2.27 U4.2(OUT0)
DAC_1_2: HD2.25 U4.3(OUT1)
DAC_1_3: HD2.23 U4.4(OUT2)
DAC_1_4: HD2.21 U4.5(OUT3)
DAC_1_5: HD2.19 U4.8(OUT4)
DAC_1_6: HD2.17 U4.9(OUT5)
DAC_1_7: HD2.15 U4.10(OUT6)
DAC_1_8: HD2.13 U4.11(OUT7)
DAC_2_1: HD1.8 U5.2(OUT0)
DAC_2_2: HD1.10 U5.3(OUT1)
DAC_2_3: HD1.12 U5.4(OUT2)
DAC_2_4: HD1.14 U5.5(OUT3)
DAC_2_5: HD1.16 U5.8(OUT4)
DAC_2_6: HD1.18 U5.9(OUT5)
DAC_2_7: HD1.20 U5.10(OUT6)
DAC_2_8: HD1.22 U5.11(OUT7)
DAC_3_1: HD1.26 U6.2(OUT0)
DAC_3_2: HD1.28 U6.3(OUT1)
DAC_3_3: HD1.30 U6.4(OUT2)
DAC_3_4: HD1.32 U6.5(OUT3)
DAC_3_5: HD1.34 U6.8(OUT4)
DAC_3_6: HD1.36 U6.9(OUT5)
DAC_3_7: HD1.38 U6.10(OUT6)
DAC_3_8: HD1.40 U6.11(OUT7)
DAC_4_1: C65.2 HD1.7 R11.2
DAC_4_1r: R11.1 U7.2(OUT0)
DAC_4_2: C66.2 HD1.9 R12.2
DAC_4_2r: R12.1 U7.3(OUT1)
DAC_4_3: C67.2 HD1.11 R13.2
DAC_4_3r: R13.1 U7.4(OUT2)
DAC_4_4: C68.2 HD1.13 R14.2
DAC_4_4r: R14.1 U7.5(OUT3)
DAC_4_5: C69.2 HD1.15 R15.2
DAC_4_5r: R15.1 U7.8(OUT4)
DAC_4_6: C70.2 HD1.17 R16.2
DAC_4_6r: R16.1 U7.9(OUT5)
DAC_4_7: C71.2 HD1.19 R17.2
DAC_4_7r: R17.1 U7.10(OUT6)
DAC_4_8: C72.2 HD1.21 R18.2
DAC_4_8r: R18.1 U7.11(OUT7)
DAC_5_1: C81.2 HD1.25 R19.2
DAC_5_1r: R19.1 U8.2(OUT0)
DAC_5_2: C82.2 HD1.27 R20.2
DAC_5_2r: R20.1 U8.3(OUT1)
DAC_5_3: C83.2 HD1.29 R21.2
DAC_5_3r: R21.1 U8.4(OUT2)
DAC_5_4: C84.2 HD1.31 R22.2
DAC_5_4r: R22.1 U8.5(OUT3)
DAC_5_5: C85.2 HD1.33 R23.2
DAC_5_5r: R23.1 U8.8(OUT4)
DAC_5_6: C86.2 HD1.35 R24.2
DAC_5_6r: R24.1 U8.9(OUT5)
DAC_5_7: C87.2 HD1.37 R25.2
DAC_5_7r: R25.1 U8.10(OUT6)
DAC_5_8: C88.2 HD1.39 R26.2
DAC_5_8r: R26.1 U8.11(OUT7)
DAC_CSn: JP_DAC_4.2 U4.12(~{CS}) U5.12(~{CS}) U6.12(~{CS}) U7.12(~{CS}) U8.12(~{CS})
DAC_SCK: JP_DAC_2.2 U4.13(SCLK) U5.13(SCLK) U6.13(SCLK) U7.13(SCLK) U8.13(SCLK)
DAC_SDI: JP_DAC_3.2 U4.14(SDI)
DAQ_AI0: HD0.38 JP6.2
DAQ_AI0B: B0.68 JP6.3 R66.1
DAQ_AI0bi: JP6.1 U10.3(+IN_A)
DAQ_AI1: HD0.40 JP7.2
DAQ_AI1B: B0.33 JP7.3 R69.1
DAQ_AI1in: JP7.1 U10.5(+IN_B)
DAQ_AI2: HD0.39 JP8.2
DAQ_AI2B: B0.65 JP8.3 R68.2
DAQ_AI2in: JP8.1 U10.10(+IN_C)
DAQ_AI3: HD0.37 JP10.2
DAQ_AI3B: B0.30 JP10.3 R67.2
DAQ_AI3in: JP10.1 U10.12(+IN_D)
DAQ_AI4: B0.28 HD0.33
DAQ_AI5: B0.60 HD0.34
DAQ_AI6: B0.25 HD0.31
DAQ_AI7: B0.57 HD0.32
DAQ_AI8: B0.34 HD3.40
DAQ_AI9: B0.66 HD3.39
DAQ_AI10: B0.31 HD3.38
DAQ_AI11: B0.63 HD3.37
DAQ_AI12: B0.61 HD3.36
DAQ_AI13: B0.26 HD3.35
DAQ_AI14: B0.58 HD3.34
DAQ_AI15: B0.23 HD3.33
DAQ_AIGND0: B0.24 B0.27 B0.29 B0.32 B0.56 B0.59 B0.64 B0.67 HD0.29 HD0.35 HD0.36 HD3.31 HD3.32 L4.2
DAQ_AISENSE0: B0.62 HD0.30
DAQ_AO0: B0.22 HD3.30
DAQ_AO1: B0.21 HD3.29
DAQ_AOGND0: B0.54 B0.55 HD3.28 L5.2
DAQ_DGND0: B0.15 HD3.25 HD3.26
DAQ_DIO0: B0.52 U11.21(B1)
DAQ_DIO0t: HD3.15 U11.3(A1)
DAQ_DIO1: B0.17 JP_DAC_3.1 U11.20(B2)
DAQ_DIO1t: HD3.13 U11.4(A2)
DAQ_DIO2: B0.49 JP_DAC_2.1 U11.19(B3)
DAQ_DIO2t: HD3.11 U11.5(A3)
DAQ_DIO3: B0.47 JP_DAC_4.1 U11.18(B4)
DAQ_DIO3t: HD3.9 U11.6(A4)
DAQ_DIO4: B0.19 U11.17(B5)
DAQ_DIO4t: HD3.7 U11.7(A5)
DAQ_DIO5: B0.51 U11.16(B6)
DAQ_DIO5t: HD3.5 U11.8(A6)
DAQ_DIO6: B0.16 U11.15(B7)
DAQ_DIO6t: HD3.3 U11.9(A7)
DAQ_DIO7: B0.48 U11.14(B8)
DAQ_DIO7t: HD3.1 U11.10(A8)
DAQ_DVDD5: B0.8 B0.14 C50.2 C51.2 HD3.27 JP4.1 JP_DVDD.1 U11.23(VCCB) U11.24(VCCB)
DAQ_PFI0: B0.11 HD3.23
DAQ_PFI1: B0.10 HD3.21
DAQ_PFI2: B0.43 HD3.19
DAQ_PFI3: B0.42 HD3.17
DAQ_PFI4: B0.41 HD3.24
DAQ_PFI5: B0.6 HD3.22
DAQ_PFI6: B0.5 HD3.20
DAQ_PFI7: B0.38 HD3.18
DAQ_PFI8: B0.37 HD3.16
DAQ_PFI9: B0.3 HD3.14
DAQ_PFI10: B0.45 HD3.12
DAQ_PFI11: B0.46 HD3.10
DAQ_PFI12: B0.2 HD3.8
DAQ_PFI13: B0.40 HD3.6
DAQ_PFI14: B0.1 HD3.4
DAQ_PFI15: B0.39 HD3.2
DVDD1.8: HD0.2 JP5.2 JP_VLT.3 JP_VLT1.3 Q1.1(G) R10.2
MCU_ADC1: HD0.21 R92.1 U13.23(PA1)
MCU_ADC2: HD0.23 R93.1 U13.24(PA2)
MCU_ADC3: HD0.25 R94.1 U13.25(PA3)
MCU_ADC4: HD0.27 R95.1 U13.28(PA4)
MCU_DAC_CLRn: U13.47(PB11)
MCU_DAC_CSn: JP_DAC_4.3 U13.41(PE11)
MCU_DAC_SCK: JP_DAC_2.3 U13.42(PE12)
MCU_DAC_SDI: JP_DAC_3.3 U13.44(PE14)
MCU_DIO0: R70.1 U19.21(B1)
MCU_DIO0t: HD0.20 U19.3(A1)
MCU_DIO1: R71.1 U19.20(B2)
MCU_DIO1t: HD0.18 U19.4(A2)
MCU_DIO2: R72.1 U19.19(B3)
MCU_DIO2t: HD0.16 U19.5(A3)
MCU_DIO3: R73.1 U19.18(B4)
MCU_DIO3t: HD0.14 U19.6(A4)
MCU_DIO4: R74.1 U19.17(B5)
MCU_DIO4t: HD0.12 U19.7(A5)
MCU_DIO5: R75.1 U19.16(B6)
MCU_DIO5t: HD0.10 U19.8(A6)
MCU_DIO6: R76.1 U19.15(B7)
MCU_DIO6t: HD0.8 U19.9(A7)
MCU_DIO7: R77.1 U19.14(B8)
MCU_DIO7t: HD0.6 U19.10(A8)
MCU_DIO8: HD0.7 R78.1
MCU_DIO9: HD0.9 R79.1
MCU_DIO12/PWM: HD0.11 R81.1
MCU_DIO13/PWM: HD0.13 R82.1
MCU_DIO14/PWM: HD0.15 R83.1
MCU_DIO15/PWM: HD0.17 R84.1
NRST: C77.2 S1.1(NO_1) SWD.5 U13.14(NRST)
OA1: C125.1 IC1.14 R88.1
OA2: C123.1 IC1.15 R86.1
OB1: C126.1 IC1.13 R89.1
OB2: C124.1 IC1.12 R87.1
OB3: C120.1 IC1.11 R85.1
OUTA: IC1.16 IC1.19 JP35.1
OUTB: IC1.7 IC1.10 JP37.1
PH0_OSC: C103.2 U13.12(PH0-OSC_IN) Y1.1
PH1_OSC: C104.2 U13.13(PH1-OSC_OUT) Y1.3
REF: C105.1 C106.1 C107.1 C108.1 C111.1 HD2.11 JP29.2 U4.1(REF) U5.1(REF) U6.1(REF) U7.1(REF) U8.1(REF)
REGREF: C112.2 C113.2 C127.1 C128.2 IC1.9 IC1.17 JP29.1 JP34.1 JP36.1 U18.6(VOUT)
SDO1: R90.1 U5.14(SDI)
SDO2: R91.1 U6.14(SDI)
SDO3: R96.1 U7.14(SDI)
SDO4: R99.1 U8.14(SDI)
SDO5: U8.15(SDO/~{ALARM})
SELA0: IC1.2 U13.39(PE9)
SELA1: IC1.1 U13.40(PE10)
SELB0: IC1.4 U13.38(PE8)
SELB1: IC1.5 U13.37(PE7)
SPI2_MISO: JP30.1 R27.1 U13.53(PB14) U14.21(DOUT)
SPI2_MOSI: U13.54(PB15) U14.20(DIN) U15.20(DIN)
SPI2_NSS: U13.51(PB12)
SPI2_SCK: U13.52(PB13) U14.22(SCLK) U15.22(SCLK)
SWCLK: SWD.3 U13.76(PA14)
SWDIO: SWD.2 U13.72(PA13)
SWO: SWD.4 U13.89(PB3)
USB_5V: C129.2 CR1.5 HD0.1 J1.A4_B9(VBUS) J1.B4_A9(VBUS) LED5.2
USB_DM_CONN: CR1.6 J1.A7(D-_A) J1.B7(D-_B)
USB_DM_MCU: R97.1 U13.70(PA11)
USB_DP_CONN: CR1.4 J1.A6(D+_A) J1.B6(D+_B)
USB_DP_MCU: R98.1 U13.71(PA12)
VU: C1.1 C4.1 JP0.2 U1.3(IN) U2.3(IN)
NetC0_1: C0.1 JP0.1 JPW0.1 LED1.2 LED6.2
NetC2_1: C2.1 R1.1 R2.2(TAP) U1.1(ADJ)
NetC3_1: C3.1 JP1.1 R1.2 U1.2(OUT) U1.4(TAB)
NetC5_1: C5.1 R3.1 R4.2(TAP) U2.1(ADJ)
NetC6_1: C6.1 JP2.1 R3.2 U2.2(OUT) U2.4(TAB)
NetC22_1: C22.1 U14.12(VREFP)
NetC23_1: C23.1 U15.12(VREFP)
NetC52_2: C52.2 JP4.2 JP9.2 JP_VLT.2 U11.1(VCCA)
NetC54_2: C54.2 JP5.1 U12.5(OUT)
NetC61_2: C61.2 U14.14(REFEXT)
NetC62_2: C62.2 U15.14(REFEXT)
NetC63_2: C63.2 U14.28(CAP)
NetC64_2: C64.2 U15.28(CAP)
NetC94_1: C94.1 U13.48(VCAP1)
NetC95_1: C95.1 U13.73(VCAP2)
NetC119_2: C119.2 JP32.2 JP33.2 JP_VLT1.2 U19.1(VCCA)
NetCR1_1: CR1.1 R97.2
NetCR1_3: CR1.3 R98.2
NetJ1_A5: J1.A5(CC1_A) R62.2
NetJ1_B5: J1.B5(CC1_B) R64.1
NetJ1_SH1: J1.SH1(SHIELD) J1.SH2(SHIELD) J1.SH3(SHIELD) J1.SH4(SHIELD) R65.2
NetJP9_1: JP9.1 R7.1 U11.2(DIR)
NetJP19_2: JP19.2 L2.2
NetJP28_1: JP28.1 R45.1 U13.94(BOOT0)
NetJP31_2: JP31.2 L3.2
NetJP33_1: JP33.1 R80.1 U19.2(DIR)
NetJPW0_2: JPW0.2 JPW0.3 L6.1
NetLED1_1: LED1.1 R5.2
NetLED2_1: LED2.1 R6.2
NetLED3_1: LED3.1 R8.2
NetLED4_1: LED4.1 R9.2
NetLED5_1: LED5.1 R63.2
NetLED6_1: LED6.1 R102.2
NetLED7_1: LED7.1 R103.2
NetLED8_1: LED8.1 R104.2
NetLED9_1: LED9.1 R105.2
NetQ1_3: Q1.3(D) R9.1 R105.1
NetR29_1: R29.1 U3.13(-IN_D) U3.14(OUT_D)
NetR30_2: R30.2 U3.1(OUT_A) U3.2(-IN_A)
NetR31_2: R31.2 U3.6(-IN_B) U3.7(OUT_B)
NetR32_1: R32.1 U3.8(OUT_C) U3.9(-IN_C)
NetR33_1: R33.1 U9.13(-IN_D) U9.14(OUT_D)
NetR34_2: R34.2 U9.1(OUT_A) U9.2(-IN_A)
NetR35_2: R35.2 U9.6(-IN_B) U9.7(OUT_B)
NetR36_1: R36.1 U9.8(OUT_C) U9.9(-IN_C)
NetR46_1: R46.1 U16.13(-IN_D) U16.14(OUT_D)
NetR47_2: R47.2 U16.1(OUT_A) U16.2(-IN_A)
NetR48_2: R48.2 U16.6(-IN_B) U16.7(OUT_B)
NetR49_1: R49.1 U16.8(OUT_C) U16.9(-IN_C)
NetR50_1: R50.1 U17.13(-IN_D) U17.14(OUT_D)
NetR51_2: R51.2 U17.1(OUT_A) U17.2(-IN_A)
NetR52_2: R52.2 U17.6(-IN_B) U17.7(OUT_B)
NetR53_1: R53.1 U17.8(OUT_C) U17.9(-IN_C)
NetR66_2: R66.2 U10.1(OUT_A) U10.2(-IN_A)
NetR67_1: R67.1 U10.13(-IN_D) U10.14(OUT_D)
NetR68_1: R68.1 U10.8(OUT_C) U10.9(-IN_C)
NetR69_2: R69.2 U10.6(-IN_B) U10.7(OUT_B)
NetR70_2: R70.2 U13.81(PD0)
NetR71_2: R71.2 U13.82(PD1)
NetR72_2: R72.2 U13.83(PD2)
NetR73_2: R73.2 U13.84(PD3)
NetR74_2: R74.2 U13.85(PD4)
NetR75_2: R75.2 U13.86(PD5)
NetR76_2: R76.2 U13.87(PD6)
NetR77_2: R77.2 U13.88(PD7)
NetR78_2: R78.2 U13.55(PD8)
NetR79_2: R79.2 U13.56(PD9)
NetR81_2: R81.2 U13.59(PD12)
NetR82_2: R82.2 U13.60(PD13)
NetR83_2: R83.2 U13.61(PD14)
NetR84_2: R84.2 U13.62(PD15)
NetR90_2: R90.2 U4.15(SDO/~{ALARM})
NetR91_2: R91.2 U5.15(SDO/~{ALARM})
NetR96_2: R96.2 U6.15(SDO/~{ALARM})
NetR99_2: R99.2 U7.15(SDO/~{ALARM})
NetR100_1: R100.1 U19.22(~{OE})
NetR101_1: R101.1 U11.22(~{OE})

Not connected (* = marked no-connect by the designer): B0 20 69(MH1) 70(MH2); HD0 19 22; HD1 1 2 3 4; HD2 1 2 3 5 6 8; J1 A8(SBU1) B8(SBU2); R2 1(TOP); R4 1(TOP); S1 2(NO_2) 3(COM_1); U12 4(N/C); U13 5(PE6) 7(PC13) 8(PC14-OSC32_IN) 9(PC15-OSC32_OUT) 15(PC0) 16(PC1) 17(PC2_C) 18(PC3_C) 22(PA0-WKUP) 29(PA5) 30(PA6) 31(PA7) 32(PC4) 33(PC5) 34(PB0) 35(PB1) 36(PB2) 43(PE13) 45(PE15) 46(PB10) 57(PD10) 58(PD11) 63(PC6) 64(PC7) 65(PC8) 66(PC9) 68(PA9) 69(PA10) 77(PA15) 78(PC10) 79(PC11) 80(PC12) 90(PB4) 91(PB5) 92(PB6) 93(PB7) 95(PB8) 96(PB9); U14 18(DONE_N) 24(NC)* 26(XTAL2)*; U15 18(DONE_N) 24(NC)* 26(XTAL2)*; U18 1(NIC) 3(NIC) 5(NIC) 7(NIC) 8(DNC)

## Notes on the sheet
- AGND
- DGND
- DVDD_5V
- This ADC is for Unipolar 0-4V Measurement
- (near C2) AGND
- M mode here
- (near JP30) GND
- Share MOSI 1 readinga at a time
- (near J1) No VDD33USB
- (near IC1) SELA0
- (near IC1) V+
- (near IC1) Expad
- (near IC1) SELA1
- (near IC1) INSB
- (near IC1) OUTSB3
- (near IC1) GND
- (near IC1) SELB0
- (near IC1) SELB1
- (near IC1) V-
- (near IC1) OUTB
- (near IC1) OUTSB2
- (near IC1) OUTSB1
- (near IC1) OUTSA1
- (near IC1) OUTSA2
- (near IC1) INSA
- (near IC1) -INB
- (near IC1) +INB
- (near IC1) +INA
- (near IC1) -INA
- (near IC1) OUTA
- (in symbol OPA4388IDR, part A) null; +; -
- (in symbol OPA4388IDR, part B) +; null; -
- (in symbol OPA4388IDR, part C) +; null; -
- (in symbol OPA4388IDR, part D) +; null; -
- (in symbol STM32H743VIT6, part A) 1 of 3
- (in symbol STM32H743VIT6, part B) 2 of 3
- (in symbol STM32H743VIT6, part C) 3 of 3

## Library data of the parts
B0 = 2-174339-5: Cap Header, Vertical /M2.5 AMPLIMITE 050 Series II; Package Information: Latest Revision: May-1991; Positions: 68; Gender: Plug Header; Note: Without Mating Lock; PCB Layout: Complies with manufacturer's recommendation.; Drill Size: Corresponds to nominal value.; Published: 17-Jul-2002; Revision: 21-Nov-2002: PCB Footprint sequence changed.; Datasheet: (23-May-91); Package Reference: 050DSUB1.27-2V68D; Publisher: Altium Limited; Orientation: Vertical; Note: Series II
C0 = Cap Pol3: Polarized Capacitor (Surface Mount); Value: 22uF; Published: 8-Jun-2000; Revision: July-2002: Re-released for DXP Platform.; Publisher: Altium Limited
C1-C6 = Cap Pol3: Polarized Capacitor (Surface Mount); Value: 10uF; Published: 8-Jun-2000; Revision: July-2002: Re-released for DXP Platform.; Publisher: Altium Limited
C7 C9 C11 C60 C114 = Cap Pol3: Polarized Capacitor (Surface Mount); Value: 1uF; Published: 8-Jun-2000; Revision: July-2002: Re-released for DXP Platform.; Publisher: Altium Limited
C8 C10 C12-C14 C19 C57 C115 C116 = Cap: Capacitor; Value: 100pF; Published: 8-Jun-2000; Revision: July-2002: Re-released for DXP Platform.; Publisher: Altium Limited
C15 C20 C22 C23 C32 C42 C51 C53 C54 C61-C64 C93-C95 C102-C109 C111 C112 C118 C121 C122 C127-C129 = CC0603KRX7R7BB105: No Description Available; Manufacturer_Name: Yageo; Copyright: Copyright (C) 2025 Ultra Librarian. All rights reserved.; Manufacturer_Part_Number: CC0603KRX7R7BB105; Supplier 1: Avnet; Supplier Part Number 1: CC0603KRX7R7BB105
C16 C18 C21 C25 C27 C29 C31 C33 C35 C37 C39 C41 C43 C45 C47 C49 C50 C52 C56 C76 C77 C79 C92 C96-C101 C110 C117 C119 = CC0603KRX7R7BB104: No Description Available; Manufacturer_Name: Yageo; Copyright: Copyright (C) 2025 Ultra Librarian. All rights reserved.; Manufacturer_Part_Number: CC0603KRX7R7BB104; Supplier 1: Avnet; Supplier Part Number 1: CC0603KRX7R7BB104
C17 C24 C26 C28 C30 C34 C36 C38 C40 C44 C46 C48 C55 C75 C78 C113 = CL21B106KOQNNNE: No Description Available; Manufacturer_Name: Samsung; Copyright: Copyright (C) 2025 Ultra Librarian. All rights reserved.; Manufacturer_Part_Number: CL21B106KOQNNNE; Supplier 1: DigiKey; Supplier Part Number 1: 1276-2872-6-ND
C58 C59 C65-C74 C80-C91 = GRM21BR60J107ME15L: 100 ÂµF Â±20% 6.3V Ceramic Capacitor X5R 0805 (2012 Metric); MF: Murata; SnapEDA_Link: https://www.snapeda.com/parts/GRM21BR60J107ME15L/Murata/view-part/?ref=snap; Package: 2012 Murata; Value: *; MP: GRM21BR60J107ME15L; Check_prices: https://www.snapeda.com/parts/GRM21BR60J107ME15L/Murata/view-part/?ref=eda
C120 C123-C126 = CBR04C220F5GAC: CBR-SMD RF C0G, Ceramic, 22 pF, 1%, 50 VDC, C0G, SMD, Fixed, RF, Ultra High Q, Low ESR, Class I, 0402; Manufacturer_Name: Kemet; Copyright: Copyright (C) 2025 Ultra Librarian. All rights reserved.; Manufacturer_Part_Number: CBR04C220F5GAC
CR1 = USBLC6-2SC6: ESD Protection for USB 2.0 High Speed; Manufacturer_Name: STMicroelectronics; Copyright: Copyright (C) 2025 Ultra Librarian. All rights reserved.; Manufacturer_Part_Number: USBLC6-2SC6; RefDes: RefDes; Type: Type
HD0-HD3 = Header 20X2: Header, 20-Pin, Dual row; Revision: 17-Jul-2002: Re-released for DXP Platform.; Publisher: Altium Limited
IC1 = OPA3S328RGRR: High-speed (40 MHz) high-precision (60 ÂµV) low-noise op amp with integrated gain switches 20-VQFN -40 to 125; Manufacturer_Name: Texas Instruments; Copyright: Copyright (C) 2026 Ultra Librarian. All rights reserved.; Manufacturer_Part_Number: OPA3S328RGRR; RefDes: RefDes; Type: Type
J1 = 12402012E212A: USB2.0, Type C, Top mount, CH 1.68mm, Dual Row SMT; MF: Amphenol ICC (Commercial Products); MP: 12402012E212A; Price: None; Package: None; Availability: In Stock; SnapEDA_Link: https://www.snapeda.com/parts/12402012E212A/Amphenol/view-part/?ref=snap; Value: *; Check_prices: https://www.snapeda.com/parts/12402012E212A/Amphenol/view-part/?ref=eda; Purchase-URL: https://pricing.snapeda.com/search/part/12402012E212A/?ref=eda
JGND SWD = 826632-3: PCB Breakaway Header, 2.54mm, 3 Way 2 Row, Gold, AMPMODU Headers Series | TE Connectivity 826632-3; SnapEDA_Link: https://www.snapeda.com/parts/826632-3/TE+Connectivity+AMP+Connectors/view-part/?ref=snap; Package: None; Value: *; MF: TE Connectivity; MP: 826632-3; EU_RoHS_Compliance: Compliant; Check_prices: https://www.snapeda.com/parts/826632-3/TE+Connectivity+AMP+Connectors/view-part/?ref=eda
JGND2 JP6-JP8 JP10-JP18 JP20-JP27 JP30 JP34-JP37 JP_VLT JP_VLT1 = JP3_1: Jumper
JP0-JP2 JP4 JP5 JP9 JP19 JP28 JP29 JP31-JP33 = JP2: Jumper
JP_DAC_2-JP_DAC_4 JP_DVDD = JP3: Jumper
JPW0 = PWR2.5: Low Voltage Power Supply Connector; Published: 17-Dec-2003; Datasheet: Latest Revision: 09-May-2002; Publisher: Altium Limited
L2-L6 = Inductor: Value: 10mH; Published: 8-Jun-2000; Revision: July-2002: Re-released for DXP Platform.; Publisher: Altium Limited
LED1-LED9 = LG L29K-F2J1-24-Z: Description; Manufacturer_Name: ams OSRAM; Copyright: Copyright (C) 2025 Ultra Librarian. All rights reserved.; Manufacturer_Part_Number: LG L29K-F2J1-24-Z
Q1 = BSS138LT3G: MF: {'manufacturer': u'onsemi'}; Package: None; Price: None; Value: *; MP: BSS138LT3G; Availability: Unavailable
R1 R3 = Res3: Resistor; Published: 8-Jun-2000; Revision: July-2002: Re-released for DXP Platform.; Publisher: Altium Limited; Value: 500
R2 R4 = POT_: Potentiometer; Set Position: 0.5; Value: 1K; Published: 8-Jun-2000; Revision: July-2002: Re-released for DXP Platform.; Publisher: Altium Limited
R5-R10 R27 R28 R45 R62-R65 R70-R84 R90-R105 = ERA3AEB2491V: Price: None; Availability: Unavailable; Package: None; Value: *; MP: ERA3AEB2491V
R11-R26 R29-R44 R46-R61 R66-R69 = RG1608P-221-B-T5: Package: None; Price: None; Value: *; MP: RG1608P-221-B-T5; Availability: Unavailable
R85-R89 = MCT0603MD2004BP500: MCT 0603-25 0.1% AT P5 2M0; Manufacturer_Name: Vishay; Copyright: Copyright (C) 2025 Ultra Librarian. All rights reserved.; Manufacturer_Part_Number: MCT0603MD2004BP500
S1 = PTS647SK38SMTR2LFS: Tactile Switch SPST-NO Top Actuated Surface Mount; MF: C&K; SnapEDA_Link: https://www.snapeda.com/parts/PTS%20647%20SK38%20SMTR2%20LFS/C%2526K/view-part/?ref=snap; Package: None; Value: *; MP: PTS 647 SK38 SMTR2 LFS; Check_prices: https://www.snapeda.com/parts/PTS%20647%20SK38%20SMTR2%20LFS/C%2526K/view-part/?ref=eda
U3 U9 U10 U16 U17 = OPA4388IDR: Quad, 10-MHz, CMOS, zero-drift, zero-crossover, true RRIO precision operational amplifier 14-SOIC -40 to 125; Manufacturer_Name: Texas Instruments; TYPE: TYPE; RefDes: RefDes; Copyright: Copyright (C) 2026 Ultra Librarian. All rights reserved.; Manufacturer_Part_Number: OPA4388IDR; Datasheet: https://www.ti.com/lit/gpn/opa4388
U12 = TPS7A2018PDBVR: MF: {'manufacturer': u'Texas Instruments'}; Package: None; Price: None; Value: *; MP: TPS7A2018PDBVR; Availability: Unavailable
U13 = STM32H743VIT6: High-performance and DSP with DP-FPU, Arm Cortex-M7 MCU with 2MBytes of Flash memory, 1MB RAM, 480 MHz CPU, Art Accelerator, L1 cache, external memory interface, large set of peripherals; Manufacturer_Name: STMicroelectronics; Copyright: Copyright (C) 2025 Ultra Librarian. All rights reserved.; Manufacturer_Part_Number: STM32H743VIT6; RefDes: RefDes; Type: Type
U14 U15 = ADS131A04IPBS: 24-bit 128-kSPS 4-channel simultaneous-sampling delta-sigma ADC 32-TQFP -40 to 125; Manufacturer_Name: Texas Instruments; TYPE: TYPE; RefDes: RefDes; Copyright: Copyright (C) 2025 Ultra Librarian. All rights reserved.; Manufacturer_Part_Number: ADS131A04IPBS
U18 = ADR4525CRZ-R7: Ultra-Low-Noise, High-Accuracy 2.5V Voltage Reference; Manufacturer_Name: Analog Devices Inc; Copyright: Copyright (C) 2025 Ultra Librarian. All rights reserved.; Manufacturer_Part_Number: ADR4525CRZ-R7; Datasheet: https://www.analog.com/media/en/technical-documentation/data-sheets/ADR4520_4525_4530_4533_4540_4550.pdf; RefDes: RefDes; Type: Type
Y1 = ABM3B-8.000MHZ-B2-T: 8 MHz Â±20ppm Crystal 18pF 200 Ohms 4-SMD, No Lead; MF: Abracon; SnapEDA_Link: https://www.snapeda.com/parts/ABM3B-8.000MHZ-B2-T/Abracon/view-part/?ref=snap; Package: SMD-4 Abracon LLC; Value: *; MP: ABM3B-8.000MHZ-B2-T; Check_prices: https://www.snapeda.com/parts/ABM3B-8.000MHZ-B2-T/Abracon/view-part/?ref=eda
U4-U8 = DAC80508ZRTER: Package: None; Price: None; Value: *; MP: DAC80508ZRTER; Availability: Unavailable
U11 U19 = SN74LVC8T245DGVR: Package: None; Price: None; Value: *; MP: SN74LVC8T245DGVR; Availability: Unavailable